# Altium schematic sheet MotorDriver.SchDoc
size A4; SheetNumber: 6; SheetTotal: 6
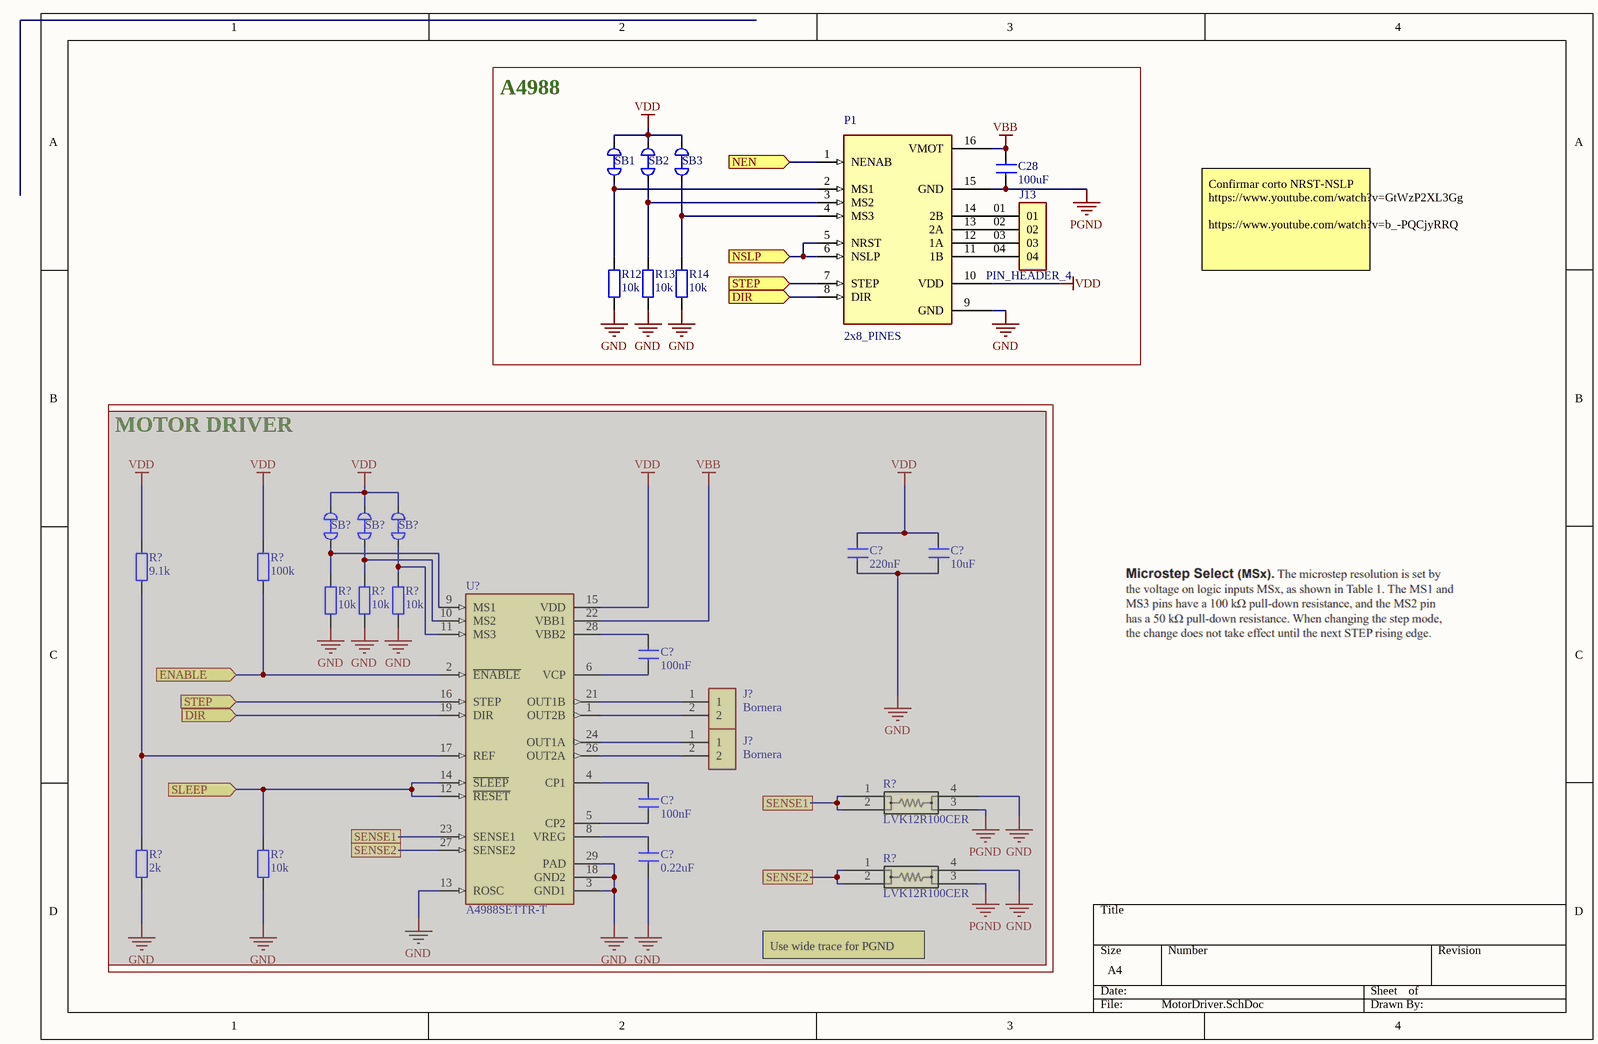
[diagram p0: MotorDriver.SchDoc]

## Parts
(Parts that share a designator on the sheet are numbered #1, #2 ... from top to bottom, then left to right.)
C28  100uF  [RES_0805]
C?#1  220nF  [RES_0805]  (masked out: inside a compile mask, not in the netlist)
C?#2  10uF  [RES_0805]  (masked out: inside a compile mask, not in the netlist)
C?#3  100nF  [RES_0805]  (masked out: inside a compile mask, not in the netlist)
C?#4  100nF  [RES_0805]  (masked out: inside a compile mask, not in the netlist)
C?#5  0.22uF  [RES_0805]  (masked out: inside a compile mask, not in the netlist)
J13  PIN_HEADER_4  [GEN_PIN4]
J?#1  Bornera  [CUI_TB002-500-02BE]  (masked out: inside a compile mask, not in the netlist)
J?#2  Bornera  [CUI_TB002-500-02BE]  (masked out: inside a compile mask, not in the netlist)
P1  2x8_PINES  [PINES8x2-sep]
R12  10k  [RES_0805]
R13  10k  [RES_0805]
R14  10k  [RES_0805]
R?#1  9.1k  [RES_0805]  (masked out: inside a compile mask, not in the netlist)
R?#2  100k  [RES_0805]  (masked out: inside a compile mask, not in the netlist)
R?#3  10k  [RES_0805]  (masked out: inside a compile mask, not in the netlist)
R?#4  10k  [RES_0805]  (masked out: inside a compile mask, not in the netlist)
R?#5  10k  [RES_0805]  (masked out: inside a compile mask, not in the netlist)
R?#6  LVK12R100CER  [LVK12_OHM-m]  (masked out: inside a compile mask, not in the netlist)
R?#7  2k  [RES_0805]  (masked out: inside a compile mask, not in the netlist)
R?#8  10k  [RES_0805]  (masked out: inside a compile mask, not in the netlist)
R?#9  LVK12R100CER  [LVK12_OHM-m]  (masked out: inside a compile mask, not in the netlist)
SB1  SolderBridge_Short  [SolderBridge_Short]  (value not drawn)
SB2  SolderBridge_Short  [SolderBridge_Short]  (value not drawn)
SB3  SolderBridge_Short  [SolderBridge_Short]  (value not drawn)
SB?#1  SolderBridge_Short  [SolderBridge_Short]  (value not drawn)  (masked out: inside a compile mask, not in the netlist)
SB?#2  SolderBridge_Short  [SolderBridge_Short]  (value not drawn)  (masked out: inside a compile mask, not in the netlist)
SB?#3  SolderBridge_Short  [SolderBridge_Short]  (value not drawn)  (masked out: inside a compile mask, not in the netlist)
U?  A4988SETTR-T  [QFN50P500X500X90-29N]  (masked out: inside a compile mask, not in the netlist)

## Blocks framed on the sheet
A4988: C28 J13 P1 R12-R14 SB1-SB3
MOTOR DRIVER: C?#1-C?#5 J?#1 J?#2 R?#1-R?#9 SB?#1-SB?#3 U?

## Ports
DIR (in, see Main[1A], Microcontroller[2C]), ENABLE (in, see Main[1A]), NEN (in, see Main[1A]), NSLP (in, see Main[1A]), SLEEP (in, see Main[1A]), STEP (in, see Main[1B], Microcontroller[2B])

## Nets
GND: P1.9(GND) R12.1 R13.1 R14.1
PGND: C28.2 P1.15(GND)
VBB: C28.1 P1.16(VMOT)
VDD: P1.10(VDD) SB1.2 SB2.2 SB3.2
DIR: P1.8(DIR) ; port DIR
NEN: P1.1(NENAB) ; port NEN
NSLP: P1.5(NRST) P1.6(NSLP) ; port NSLP
STEP: P1.7(STEP) ; port STEP
NetJ13_01: J13.01 P1.14(2B)
NetJ13_02: J13.02 P1.13(2A)
NetJ13_03: J13.03 P1.12(1A)
NetJ13_04: J13.04 P1.11(1B)
NetP1_2: P1.2(MS1) R12.2 SB1.1
NetP1_3: P1.3(MS2) R13.2 SB2.1
NetP1_4: P1.4(MS3) R14.2 SB3.1

## Notes on the sheet
- Confirmar corto NRST-NSLP
  https://www.youtube.com/watch?v=GtWzP2XL3Gg
  https://www.youtube.com/watch?v=b_-PQCjyRRQ
- (near R?#9) Use wide trace for PGND

## Library data of the parts
C28 C?#1-C?#5 = CAP_0805: Generic Capacitor
J13 = PIN_HEADER_4: Generic 40 mils drill size, 100 mils step; MF: Samtec Inc.; MP: TS-104-T-A; Check_prices: https://www.snapeda.com/parts/TS-104-T-A/Samtec+Inc./view-part/?ref=eda; Value: *; Availability: In Stock; Price: None; Package: None; SnapEDA_Link: https://www.snapeda.com/parts/TS-104-T-A/Samtec+Inc./view-part/?ref=snap; Purchase-URL: https://pricing.snapeda.com/search/part/TS-104-T-A/?ref=eda
J?#1 J?#2 = 2PBorn-TB002-500-02BE: 2~24 Poles, Screw Type, Horizontal, 5.0 Pitch, 22~12 (AWG), Terminal Block Connector; MF: Same Sky; SnapEDA_Link: https://www.snapeda.com/parts/TB002-500-02BE/Same+Sky/view-part/?ref=snap; Package: None; Value: *; MP: TB002-500-02BE; Check_prices: https://www.snapeda.com/parts/TB002-500-02BE/Same+Sky/view-part/?ref=eda
R12-R14 R?#1-R?#5 R?#7 R?#8 = RES_0805: Generic Capacitor
R?#6 R?#9 = R0_1-0_5W-LVK12R100CER: Description; Manufacturer_Name: Ohmite; Copyright: Copyright (C) 2025 Ultra Librarian. All rights reserved.; Manufacturer_Part_Number: LVK12R100CER; RefDes: RefDes; Type: Type
U? = A4988SETTR-T: DMOS Microstepping Driver with Translator And Overcurrent Protection; MF: Allegro; SnapEDA_Link: https://www.snapeda.com/parts/A4988SETTR-T/Allegro/view-part/?ref=snap; Package: QFN-28 Allegro MicroSystems LLC; Value: *; MP: A4988SETTR-T; Check_prices: https://www.snapeda.com/parts/A4988SETTR-T/Allegro/view-part/?ref=eda